# Altium project COEX GPS PROJECT.PrjPcb
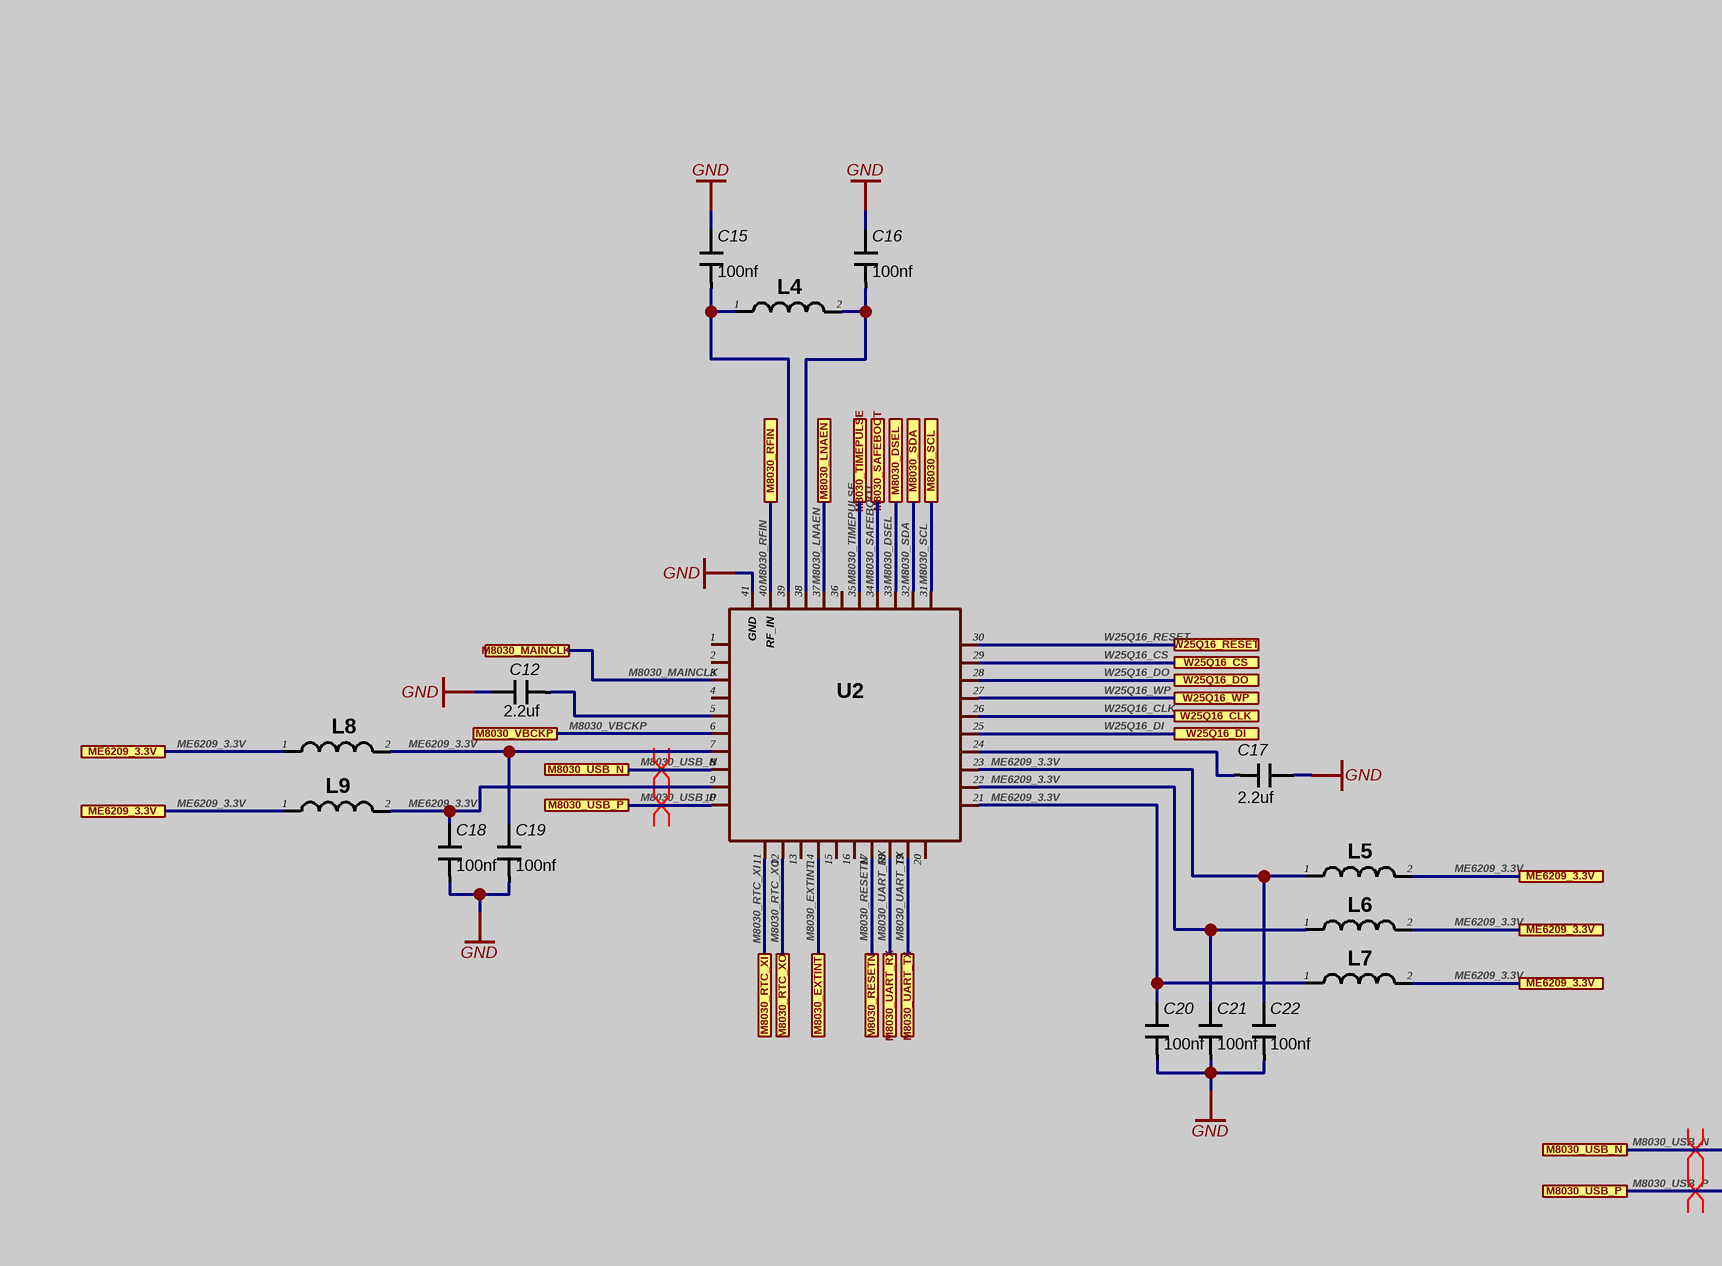
[diagram p0: COEX GPS schematics.SchDoc, top left]
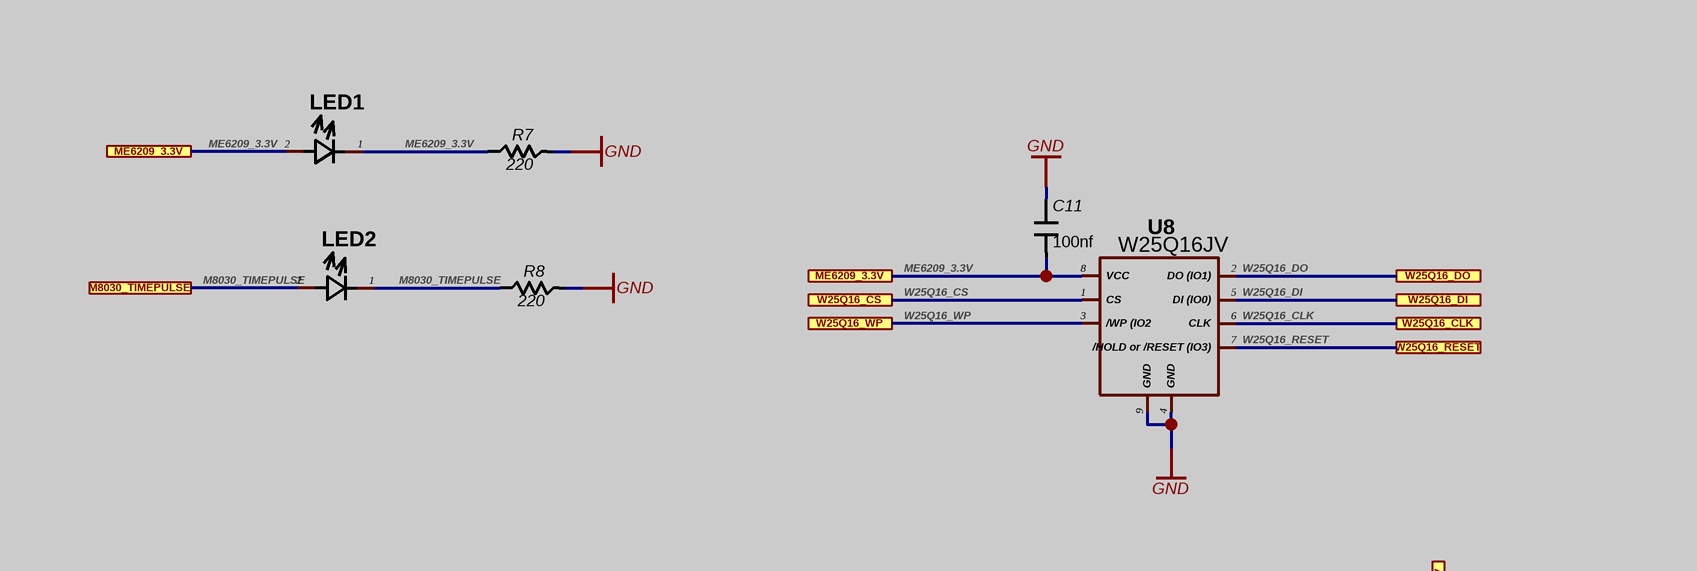
[diagram p1: COEX GPS schematics.SchDoc, top right]
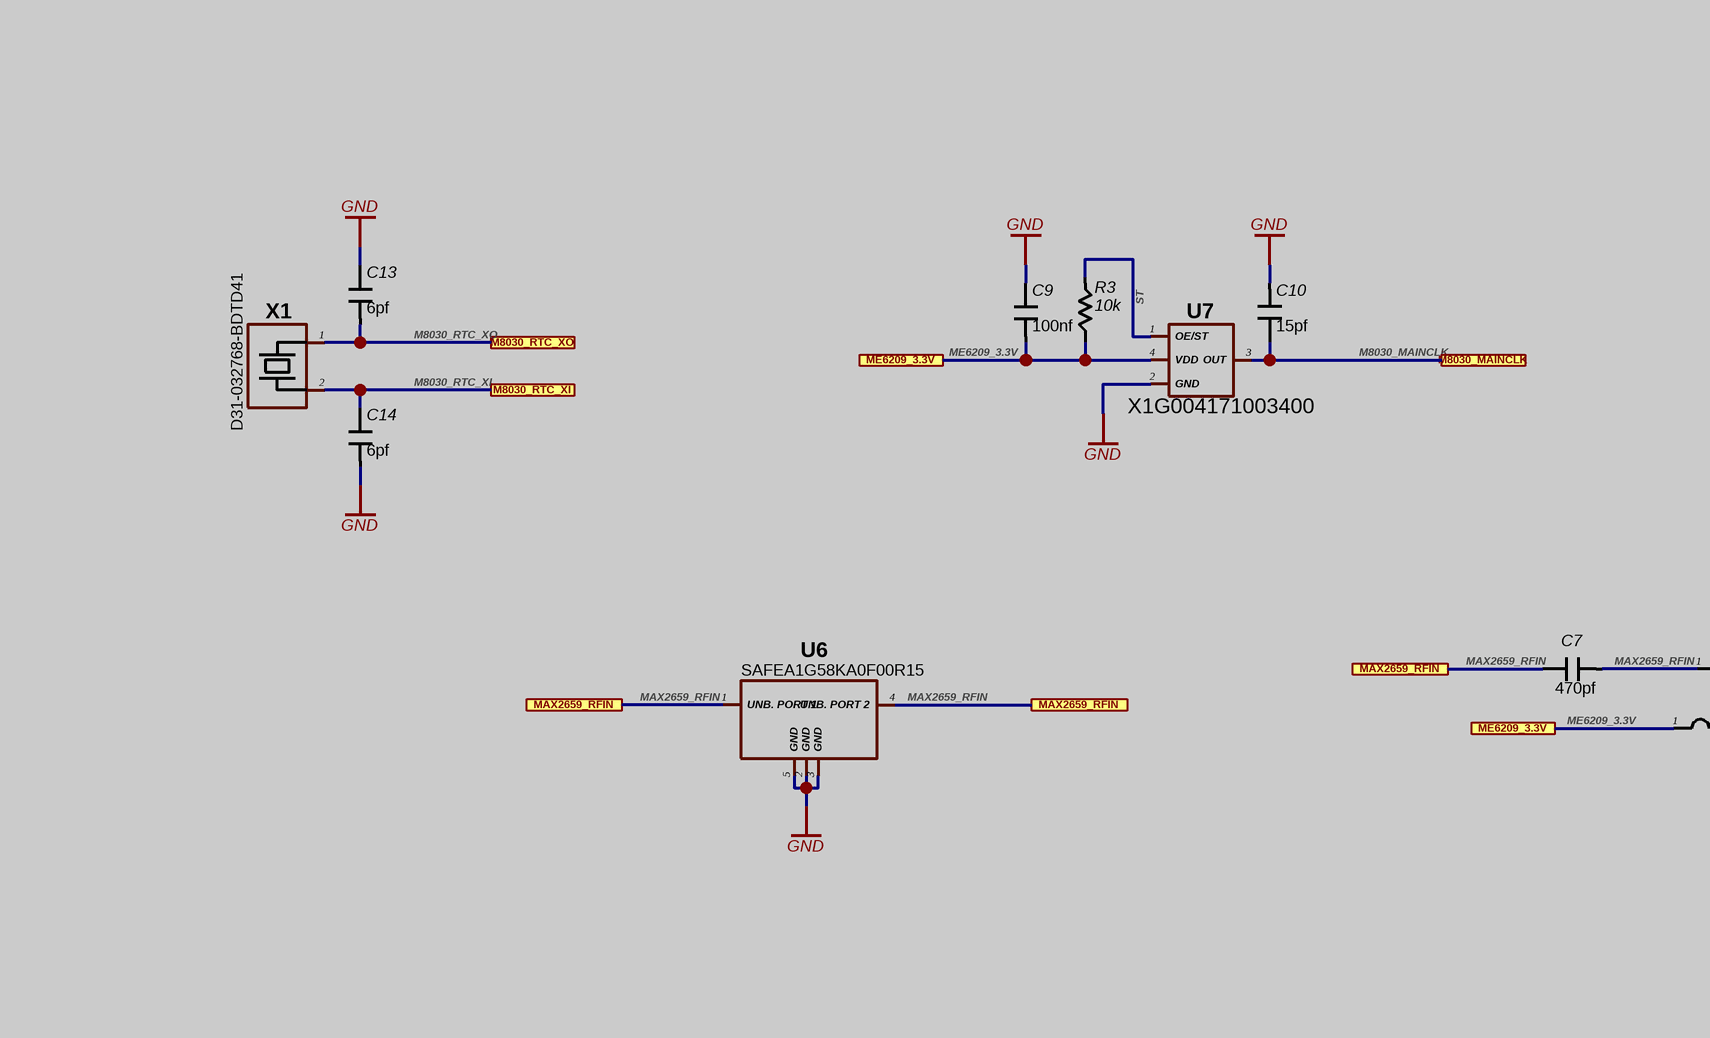
[diagram p2: COEX GPS schematics.SchDoc, bottom left]
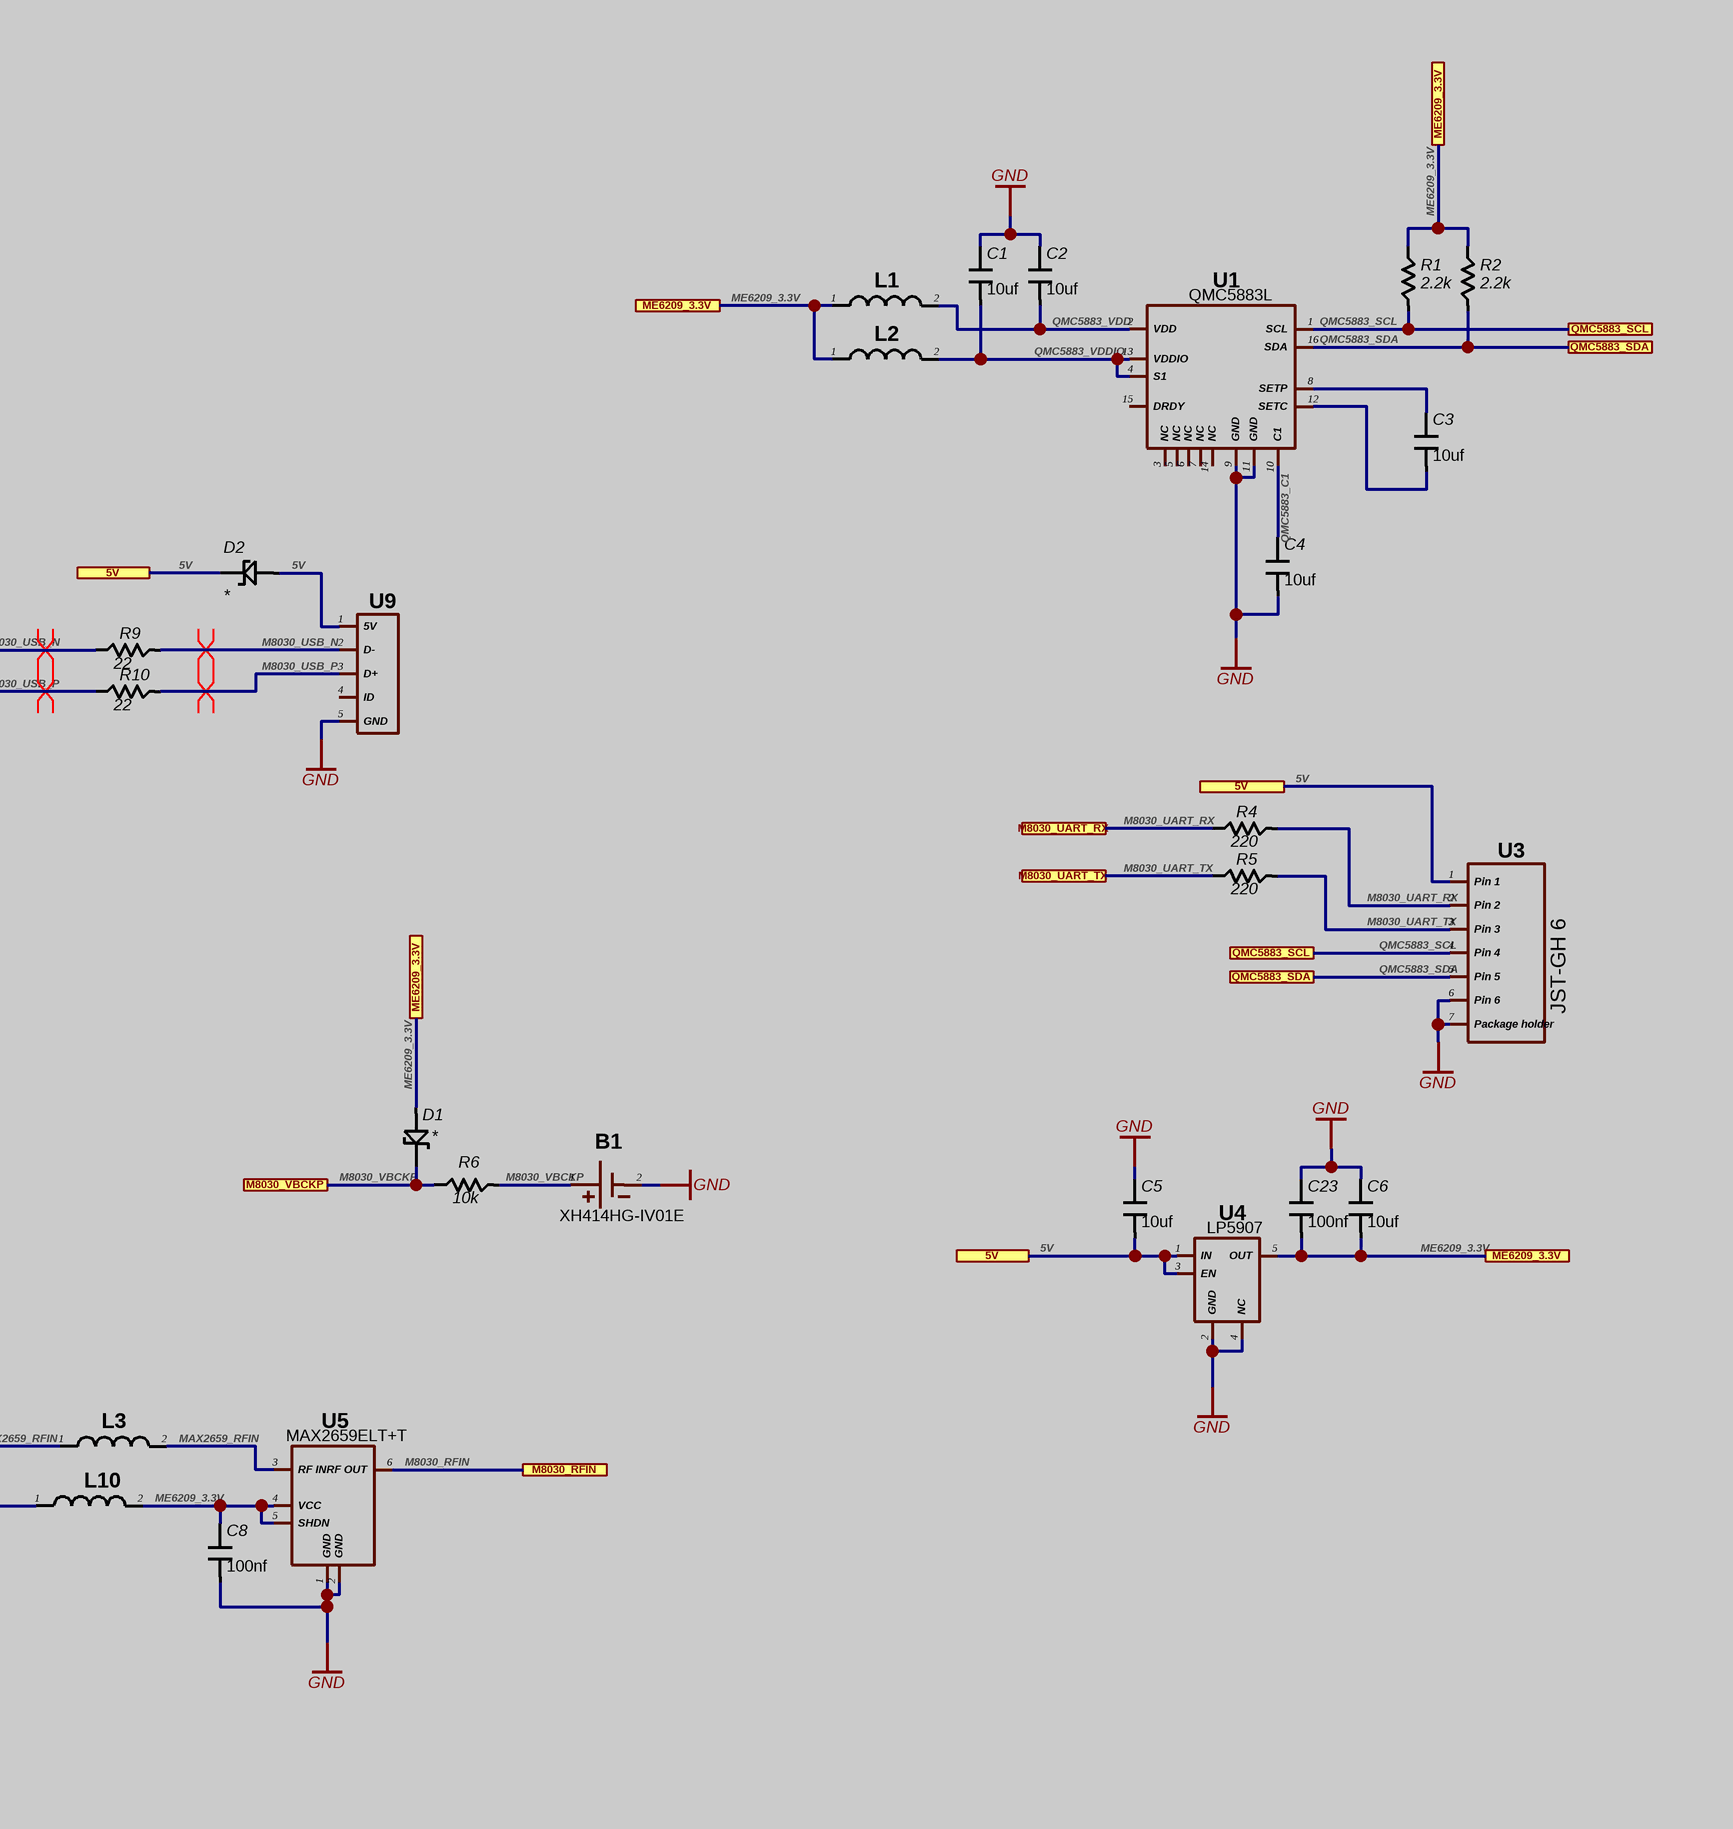
[diagram p3: COEX GPS schematics.SchDoc, bottom right]
1 sheet, 58 parts. Net scope: flat (ports and power ports of the same name join across sheets).
Board file: COEX GPS PCB.PcbDoc

## Sheet COEX GPS schematics.SchDoc
size A4

### Parts
B1  XH414HG-IV01E  [Supercapacitor]
C1  10uf  [Capasitor 0402]
C2  10uf  [Capasitor 0402]
C3  10uf  [Capasitor 0402]
C4  10uf  [Capasitor 0402]
C5  10uf  [Capasitor 0402]
C6  10uf  [Capasitor 0402]
C7  470pf  [Capasitor 0402]
C8  100nf  [Capasitor 0402]
C9  100nf  [Capasitor 0402]
C10  15pf  [Capasitor 0402]
C11  100nf  [Capasitor 0402]
C12  2.2uf  [Capasitor 0402]
C13  6pf  [Capasitor 0402]
C14  6pf  [Capasitor 0402]
C15  100nf  [Capasitor 0402]
C16  100nf  [Capasitor 0402]
C17  2.2uf  [Capasitor 0402]
C18  100nf  [Capasitor 0402]
C19  100nf  [Capasitor 0402]
C20  100nf  [Capasitor 0402]
C21  100nf  [Capasitor 0402]
C22  100nf  [Capasitor 0402]
C23  100nf  [Capasitor 0402]
D1  *  [SOD-523F]
D2  *  [SOD-523F]
L1  (no value)  [Ferrite bead 0402]
L2  (no value)  [Ferrite bead 0402]
L3  (no value)  [Ferrite bead 0402]
L4  (no value)  [Ferrite bead 0402]
L5  (no value)  [Ferrite bead 0402]
L6  (no value)  [Ferrite bead 0402]
L7  (no value)  [Ferrite bead 0402]
L8  (no value)  [Ferrite bead 0402]
L9  (no value)  [Ferrite bead 0402]
L10  (no value)  [Ferrite bead 0402]
LED1  (no value)  [Led 0603]
LED2  (no value)  [Led 0603]
R1  2.2k  [Resistor 0402]
R2  2.2k  [Resistor 0402]
R3  10k  [Resistor 0402]
R4  220  [Resistor 0402]
R5  220  [Resistor 0402]
R6  10k  [Resistor 0402]
R7  220  [Resistor 0402]
R8  220  [Resistor 0402]
R9  22  [Resistor 0402]
R10  22  [Resistor 0402]
U1  QMC5883L  [LGA16 3x3mm]
U2  (no value)  [QFN40 (5x5 mm)]
U3  JST-GH 6  [JST-GH 6 PIN]
U4  LP5907  [SOT23-5]
U5  MAX2659ELT+T  [UDFN6 (1.5 x 1 mm)]
U6  SAFEA1G58KA0F00R15  [SAFEA1G58KA0F00]
U7  X1G004171003400  [SMD-2520_4P]
U8  W25Q16JV  [USON-8 (4x3 mm)]
U9  (no value)  [Micro USB]
X1  D31-032768-BDTD41  [SMD 3215 OSC]

### Ports
5V, M8030_DSEL, M8030_EXTINT, M8030_LNAEN, M8030_MAINCLK, M8030_RESETN, M8030_RFIN, M8030_RTC_XI, M8030_RTC_XO, M8030_SAFEBOOT, M8030_SCL, M8030_SDA, M8030_TIMEPULSE, M8030_UART_RX, M8030_UART_TX, M8030_USB_N, M8030_USB_P, M8030_VBCKP, MAX2659_RFIN, ME6209_3.3V, QMC5883_SCL, QMC5883_SDA, W25Q16_CLK, W25Q16_CS, W25Q16_DI, W25Q16_DO, W25Q16_RESET, W25Q16_WP

### Nets
GND: B1.2 C1.1 C2.1 C4.2 C5.1 C6.1 C8.2 C9.1 C10.2 C11.1 C12.1 C13.1 C14.2 C15.1 C16.1 C17.1 C18.2 C19.2 C20.2 C21.2 C22.2 C23.1 R7.2 R8.2 U1.9(GND) U1.11(GND) U2.41(GND) U3.6(Pin_6) U3.7(Package_holder) U4.2(GND) U4.4(NC) U5.1(GND) U5.2(GND) U6.2(GND) U6.3(GND) U6.5(GND) U7.2(GND) U8.4(GND) U8.9(GND) U9.5(GND)
5V: C5.2 D2.1 D2.2 U3.1(Pin_1) U4.1(IN) U4.3(EN) U9.1(5V) ; port 5V
M8030_DSEL: U2.33 ; port M8030_DSEL
M8030_EXTINT: U2.14 ; port M8030_EXTINT
M8030_LNAEN: U2.37 ; port M8030_LNAEN
M8030_MAINCLK: C10.1 U2.3 U7.3(OUT) ; port M8030_MAINCLK
M8030_RESETN: U2.17 ; port M8030_RESETN
M8030_RFIN: U2.40(RF_IN) U5.6(RF_OUT) ; port M8030_RFIN
M8030_RTC_XI: C14.1 U2.11 X1.2 ; port M8030_RTC_XI
M8030_RTC_XO: C13.2 U2.12 X1.1 ; port M8030_RTC_XO
M8030_SAFEBOOT: U2.34 ; port M8030_SAFEBOOT
M8030_SCL: U2.31 ; port M8030_SCL
M8030_SDA: U2.32 ; port M8030_SDA
M8030_TIMEPULSE: LED2.1 LED2.2 R8.1 U2.35 ; port M8030_TIMEPULSE
M8030_UART_RX: R4.1 R4.2 U2.18 U3.2(Pin_2) ; port M8030_UART_RX
M8030_UART_TX: R5.1 R5.2 U2.19 U3.3(Pin_3) ; port M8030_UART_TX
M8030_USB_N: R9.1 R9.2 U2.8 U9.2(D-) ; port M8030_USB_N
M8030_USB_P: R10.1 R10.2 U2.10 U9.3(D+) ; port M8030_USB_P
M8030_VBCKP: B1.1 D1.1 R6.1 R6.2 U2.6 ; port M8030_VBCKP
MAX2659_RFIN: C7.1 C7.2 L3.1 L3.2 U5.3(RF_IN) U6.1(UNB._PORT_1) U6.4(UNB._PORT_2) ; port MAX2659_RFIN
ME6209_3.3V: C6.2 C8.1 C9.2 C11.2 C18.1 C19.1 C20.1 C21.1 C22.1 C23.2 D1.2 L1.1 L2.1 L5.1 L5.2 L6.1 L6.2 L7.1 L7.2 L8.1 L8.2 L9.1 L9.2 L10.1 L10.2 LED1.1 LED1.2 R1.1 R2.1 R3.1 R7.1 U2.7 U2.9 U2.21 U2.22 U2.23 U4.5(OUT) U5.4(VCC) U5.5(SHDN) U7.4(VDD) U8.8(VCC) ; port ME6209_3.3V
QMC5883_C1: C4.1 U1.10(C1)
QMC5883_SCL: R1.2 U1.1(SCL) U3.4(Pin_4) ; port QMC5883_SCL
QMC5883_SDA: R2.2 U1.16(SDA) U3.5(Pin_5) ; port QMC5883_SDA
QMC5883_VDD: C2.2 L1.2 U1.2(VDD)
QMC5883_VDDIO: C1.2 L2.2 U1.4(S1) U1.13(VDDIO)
ST: R3.2 U7.1(OE/ST)
W25Q16_CLK: U2.26 U8.6(CLK) ; port W25Q16_CLK
W25Q16_CS: U2.29 U8.1(CS) ; port W25Q16_CS
W25Q16_DI: U2.25 U8.5(DI_(IO0)) ; port W25Q16_DI
W25Q16_DO: U2.28 U8.2(DO_(IO1)) ; port W25Q16_DO
W25Q16_RESET: U2.30 U8.7(/HOLD_or_/RESET_(IO3)) ; port W25Q16_RESET
W25Q16_WP: U2.27 U8.3(/WP_(IO2) ; port W25Q16_WP
NetC3_1: C3.1 U1.8(SETP)
NetC3_2: C3.2 U1.12(SETC)
NetC12_2: C12.2 U2.5
NetC15_2: C15.2 L4.1 U2.39
NetC16_2: C16.2 L4.2 U2.38
NetC17_2: C17.2 U2.24

Not connected (* = marked no-connect by the designer): U1 3(NC) 5(NC) 6(NC) 7(NC) 14(NC) 15(DRDY); U2 1 2 4 13 15 16 20 36; U9 4(ID)

### Layout directives
differential pair: M8030_USB_N, M8030_USB_P

### Library data of the parts
B1 = Lithium battery: 80mF (EDLC) Supercapacitor 3.3V Coin; Manufacturer: Seiko Instruments; Partnumber: XH414HG-IV01E; HelpURL: https://www.digikey.com/product-detail/en/seiko-instruments/XH414HG-IV01E/728-1050-2-ND/1889201
C1-C12 C15-C23 = CAPASITOR MLCC: Component package: 0402; Part number: *; Manufacturer: *; HelpURL: *
  C1-C6: Value: 10uf
  C7: Value: 470pf
  C8 C9 C11 C15 C16 C18-C23: Value: 100nf
  C10: Value: 15pf
  C12 C17: Value: 2.2uf
C13 C14 = Capacitor MLCC: Component package: 0402; Value: 6pf
D1 D2 = Schottky barrier diode: Part number: *; Manufacturer: *; Web link: *; Component package: *; Value: *
L1 L2 L4-L10 = FB / Inductor
L3 = FB / Inductor: Value: 6.8nh
LED1 LED2 = LED: Component package: 0603
R1 R2 R4 R5 R7-R10 = Resistor: Part number: *; Manufacturer: *; HelpURL: *; Component package: *
  R1 R2: Value: 2.2k
  R4 R5 R7 R8: Value: 220
  R9 R10: Value: 22
R3 R6 = Resistor: Part number: RC0402FR-0710KL; Manufacturer: YAGEO; Component package: 0402; HelpURL: https://lcsc.com/product-detail/Chip-Resistor-Surface-Mount_10KR-1002-1_C60490.html; Value: 10k
U1 = QMC5883L: 3-Axis Magnetic Sensor; Component package: LGA16 (3x3 mm); Partnumber: QMC5883L
U2 = UBX M8030
U4 = LP5907: Linear Voltage Regulators SOT-23-5; Manufacturer: Texas Instruments; Value: 1.2-3.3v; Partnumber: LP5907; HelpURL: https://lcsc.com/product-detail/Linear-Voltage-Regulators_TI_LP5907MFX-3-3-NOPB_LP5907MFX-3-3-NOPB_C80670.html; Component package: SOT23-5
U5 = MAX2659ELT+T: GPS/GNSS Low-Noise Amplifier; Manufacturer: Maxim Integrated; Component package: uDFN-6; Partnumber: MAX2659ELT+T; HelpURL: https://lcsc.com/product-detail/Low-Noise-OpAmps_MAXIM_MAX2659ELT-T_MAX2659ELT-T_C28043.html
U6 = SAFEA1G58KA0F00R15: Manufacturer: Murata Electronics; Partnumber: SAFEA1G58KA0F00R15; HelpURL: https://lcsc.com/product-detail/Filters_muRata_SAFEA1G58KA0F00R15_SAFEA1G58KA0F00R15_C91641.html
U7 = SIT1602: 26MHz 1.6V ~ 3.6V SMD-2520_4P SMD Oscillator; Manufacturer: Seiko Epson; Partnumber: X1G004171003400; HelpURL: https://lcsc.com/product-detail/Others_Seiko-Epson_X1G004171003400_Seiko-Epson-X1G004171003400_C255995.html; Component package: SMD-2520_4P; Value: 26 Mhz
U8 = W25Q16JV: FLASH - NOR Memory IC 16Mb (2M x 8) SPI - Quad I/O; Manufacturer: Winbond Electronics; Partnumber: W25Q16JV; HelpURL: https://www.digikey.com/products/en/integrated-circuits-ics/memory/774?k=W25Q16JV&k=&pkeyword=W25Q16JV&sv=0&pv1291=295148&sf=0&quantity=&ColumnSort=0&page=1&pageSize=25
U9 = Micro USB
X1 = SMD OSCILLATOR 2 PIN: SMD crystal resonator 3215 2 pin; Manufacturer: AKER; Partnumber: D31-032768-BDTD41; HelpURL: https://lcsc.com/product-detail/SMD-Crystal-Resonators_AKER-D31-032768-BDTD41_C369191.html; Component package: SMD-3215
U3 = JST-GH 6: Partnumber: JST-GH 6; Component package: JST-GH 6